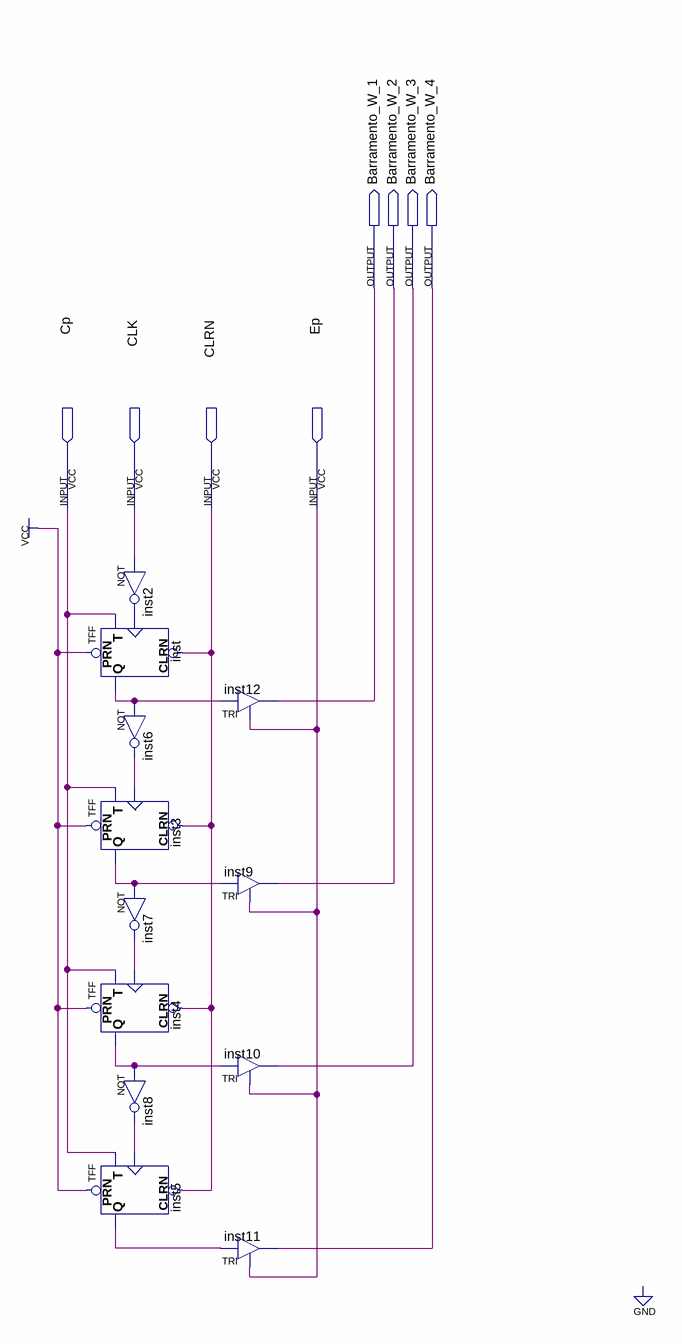
[diagram p0: schematic sheet]
// Quartus schematic Figura10_Contador_registrador_Instrucoes.bdf as structural Verilog: 12 symbols, 8 pins
module Figura10_Contador_registrador_Instrucoes (
  input  Cp,
  input  CLK,
  input  CLRN,
  input  Ep,
  output Barramento_W_1,
  output Barramento_W_2,
  output Barramento_W_3,
  output Barramento_W_4
);

  wire inst2_out, inst3_q, inst4_q, inst5_q, inst6_out, inst7_out, inst8_out, inst_q;

  not inst2 (inst2_out, CLK);
  TFF inst (.PRN(1'b1), .CLRN(CLRN), .T(Cp), .CLK(inst2_out), .Q(inst_q));
  not inst6 (inst6_out, inst_q);
  TFF inst3 (.PRN(1'b1), .CLRN(CLRN), .T(Cp), .CLK(inst6_out), .Q(inst3_q));
  not inst7 (inst7_out, inst3_q);
  TFF inst4 (.PRN(1'b1), .CLRN(CLRN), .T(Cp), .CLK(inst7_out), .Q(inst4_q));
  not inst8 (inst8_out, inst4_q);
  TFF inst5 (.PRN(1'b1), .CLRN(CLRN), .T(Cp), .CLK(inst8_out), .Q(inst5_q));
  TRI inst12 (.IN(inst_q), .OE(Ep), .OUT(Barramento_W_1));
  TRI inst9 (.IN(inst3_q), .OE(Ep), .OUT(Barramento_W_2));
  TRI inst10 (.IN(inst4_q), .OE(Ep), .OUT(Barramento_W_3));
  TRI inst11 (.IN(inst5_q), .OE(Ep), .OUT(Barramento_W_4));
endmodule
